# Altium schematic sheet RS485.SchDoc: Bernardo
size A3; Date: 14/11/2018; DrawnBy: Wim Van Gool; Revision: 01; SheetNumber: 5; SheetTotal: 7
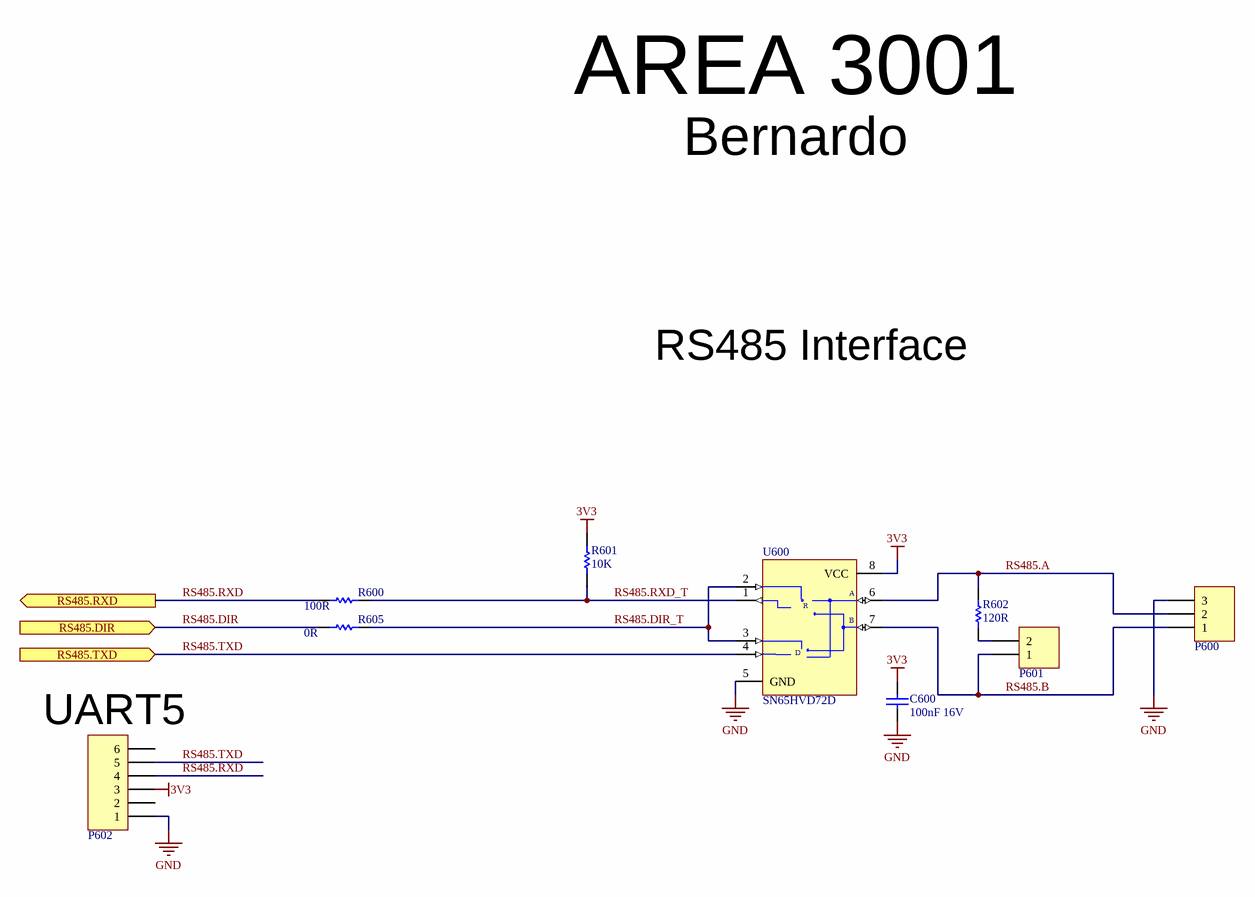
[diagram p0: RS485.SchDoc]

## Parts
C600  value 100nF 16V  [C0603_N]  (hidden comment: CAP_CERAMIC)
P600  3 Terminal Socket 2,5mm  [WE_691382000003]  (value not drawn)
P601  Header 2  [HDR1X2]  (value not drawn)
P602  Header 6  [HDR1X6]  (value not drawn)
R600  value 100R  [R0603_N]  (hidden comment: RESISTOR)
R601  value 10K  [R0603_N]  (hidden comment: RESISTOR)
R602  value 120R  [R1206]  (hidden comment: RESISTOR)
R605  value 0R  [R0603_N]  (hidden comment: RESISTOR)
U600  value SN65HVD72D  [SOIC_N_8]  (hidden comment: RS-485 3V3 Transceiver 250kbps)

## Ports
RS485.DIR (in), RS485.RXD (out), RS485.TXD (in)

## Nets
3V3: C600.1 P602.3 R601.1 U600.8(VCC)
GND: C600.2 P600.3 P602.1 U600.5(GND)
RS485.A: P600.2 R602.1 U600.6(A)
RS485.B: P600.1 P601.1 U600.7(B)
RS485.DIR: R605.2 ; port RS485.DIR
RS485.DIR_T: R605.1 U600.2(~{RE}) U600.3(DE)
RS485.RXD: P602.4 R600.2 ; port RS485.RXD
RS485.RXD_T: R600.1 R601.2 U600.1(RO)
RS485.TXD: P602.5 U600.4(DI) ; port RS485.TXD
NetP601_2: P601.2 R602.2

Not connected (* = marked no-connect by the designer): P602 2 6

## Notes on the sheet
- AREA 3001
- Bernardo
- RS485 Interface
- (near P602) UART5
- Title
- Revision
- Date
- Dranw By
- Size
- A3
- Sheet
- of
- (in symbol SN65HVD72D # RS-485 transceiver) R; D

## Library data of the parts
C600 = CAP # 100nF 16V 0603: Capacitor Ceramic
P600 = Terminal Block Socket 2,5mm 3way - 691382000003: Value: 691382000003; Supplier 1: Wurth; Supplier Part Number 1: 691382000003
P601 = Pin Header 2.54mm 2way
P602 = Pin Header 2.54mm 6way
R600 = RES # 100R 0603
R601 = RES # 10K 0603: Supplier 1: Farnell; Supplier Part Number 1: 2502397
R602 = RES # 120R 1206
R605 = RES # 0R 0603: Supplier 1: Farnell; Supplier Part Number 1: 2447743
U600 = SN65HVD72D # RS-485 transceiver: Supplier 1: Farnell; Supplier Part Number 1: 2335547